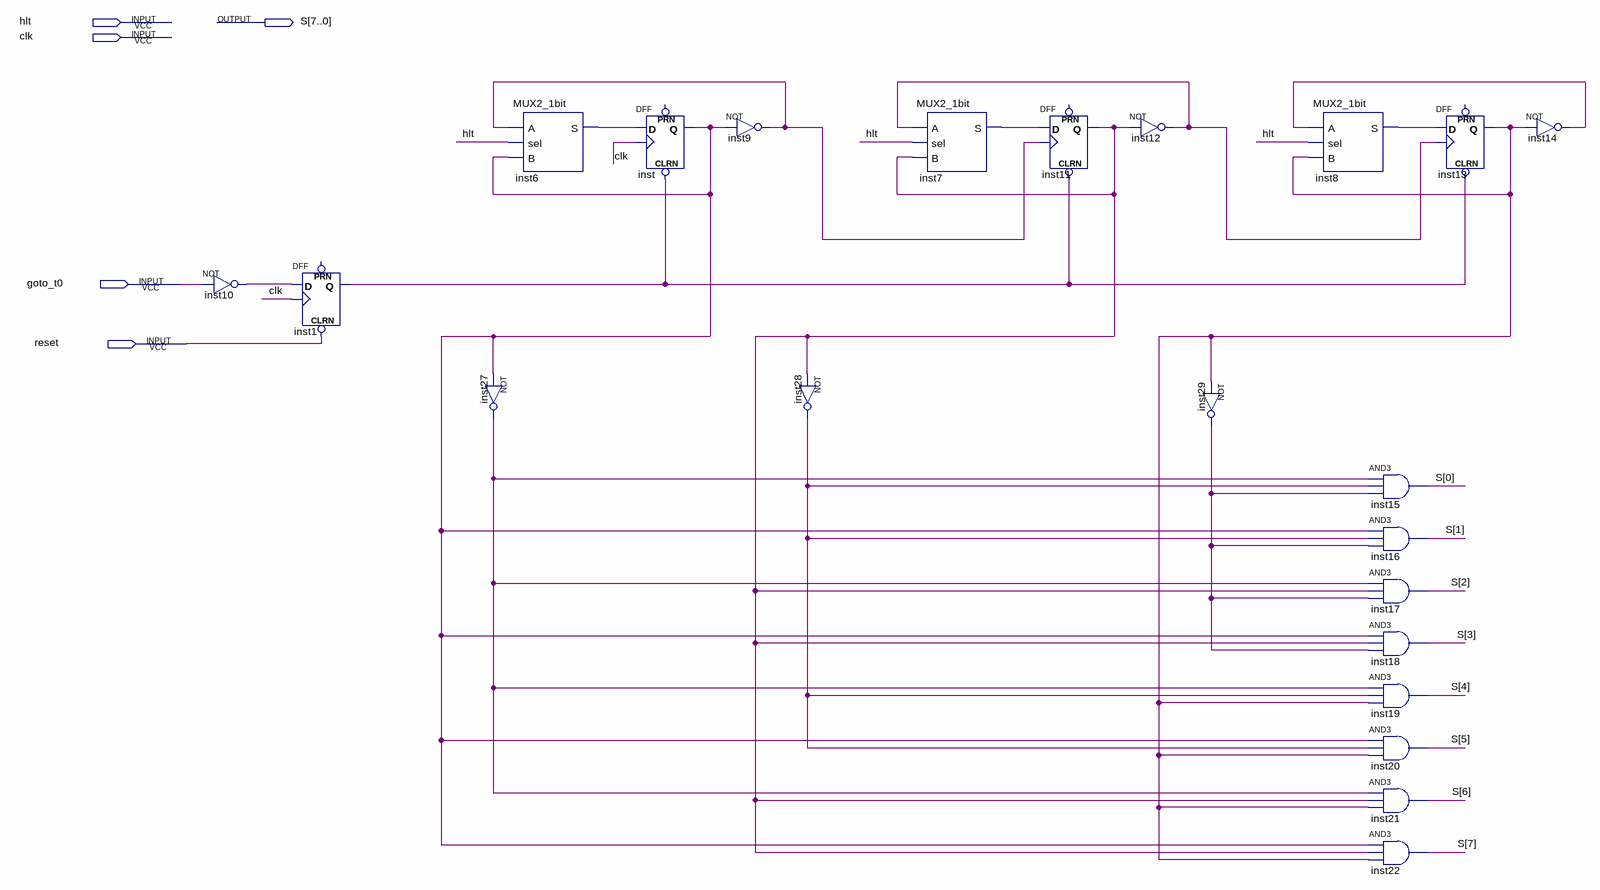
[diagram p0: schematic sheet]
// Quartus schematic Temporizador.bdf as structural Verilog: 22 symbols, 5 pins
module Temporizador (
  input  hlt,
  input  clk,
  input  goto_t0,
  input  reset,
  output [7:0] S
);

  wire inst1_q, inst6_s, inst7_s, inst8_s, inst9_out, inst10_out, inst11_q, inst12_out, inst13_q, inst14_out,
       inst27_out, inst28_out, inst29_out, inst_q;

  not inst10 (inst10_out, goto_t0);
  DFF inst1 (.CLRN(reset), .CLK(clk), .D(inst10_out), .Q(inst1_q));  // open: PRN
  not inst27 (inst27_out, inst_q);
  MUX2_1bit inst6 (.A(inst9_out), .sel(hlt), .B(inst_q), .S(inst6_s));
  DFF inst (.CLRN(inst1_q), .CLK(clk), .D(inst6_s), .Q(inst_q));  // open: PRN
  not inst9 (inst9_out, inst_q);
  not inst28 (inst28_out, inst11_q);
  MUX2_1bit inst7 (.A(inst12_out), .sel(hlt), .B(inst11_q), .S(inst7_s));
  DFF inst11 (.CLRN(inst1_q), .CLK(inst9_out), .D(inst7_s), .Q(inst11_q));  // open: PRN
  not inst12 (inst12_out, inst11_q);
  not inst29 (inst29_out, inst13_q);
  MUX2_1bit inst8 (.A(inst14_out), .sel(hlt), .B(inst13_q), .S(inst8_s));
  and inst15 (S[0], inst27_out, inst28_out, inst29_out);
  and inst16 (S[1], inst_q, inst28_out, inst29_out);
  and inst17 (S[2], inst27_out, inst11_q, inst29_out);
  and inst18 (S[3], inst_q, inst11_q, inst29_out);
  and inst19 (S[4], inst27_out, inst28_out, inst13_q);
  and inst20 (S[5], inst_q, inst28_out, inst13_q);
  and inst21 (S[6], inst27_out, inst11_q, inst13_q);
  and inst22 (S[7], inst_q, inst11_q, inst13_q);
  DFF inst13 (.CLRN(inst1_q), .CLK(inst12_out), .D(inst8_s), .Q(inst13_q));  // open: PRN
  not inst14 (inst14_out, inst13_q);
endmodule
